# Altium schematic sheet MCU_1.SchDoc
size A; SheetNumber: 4; SheetTotal: 5
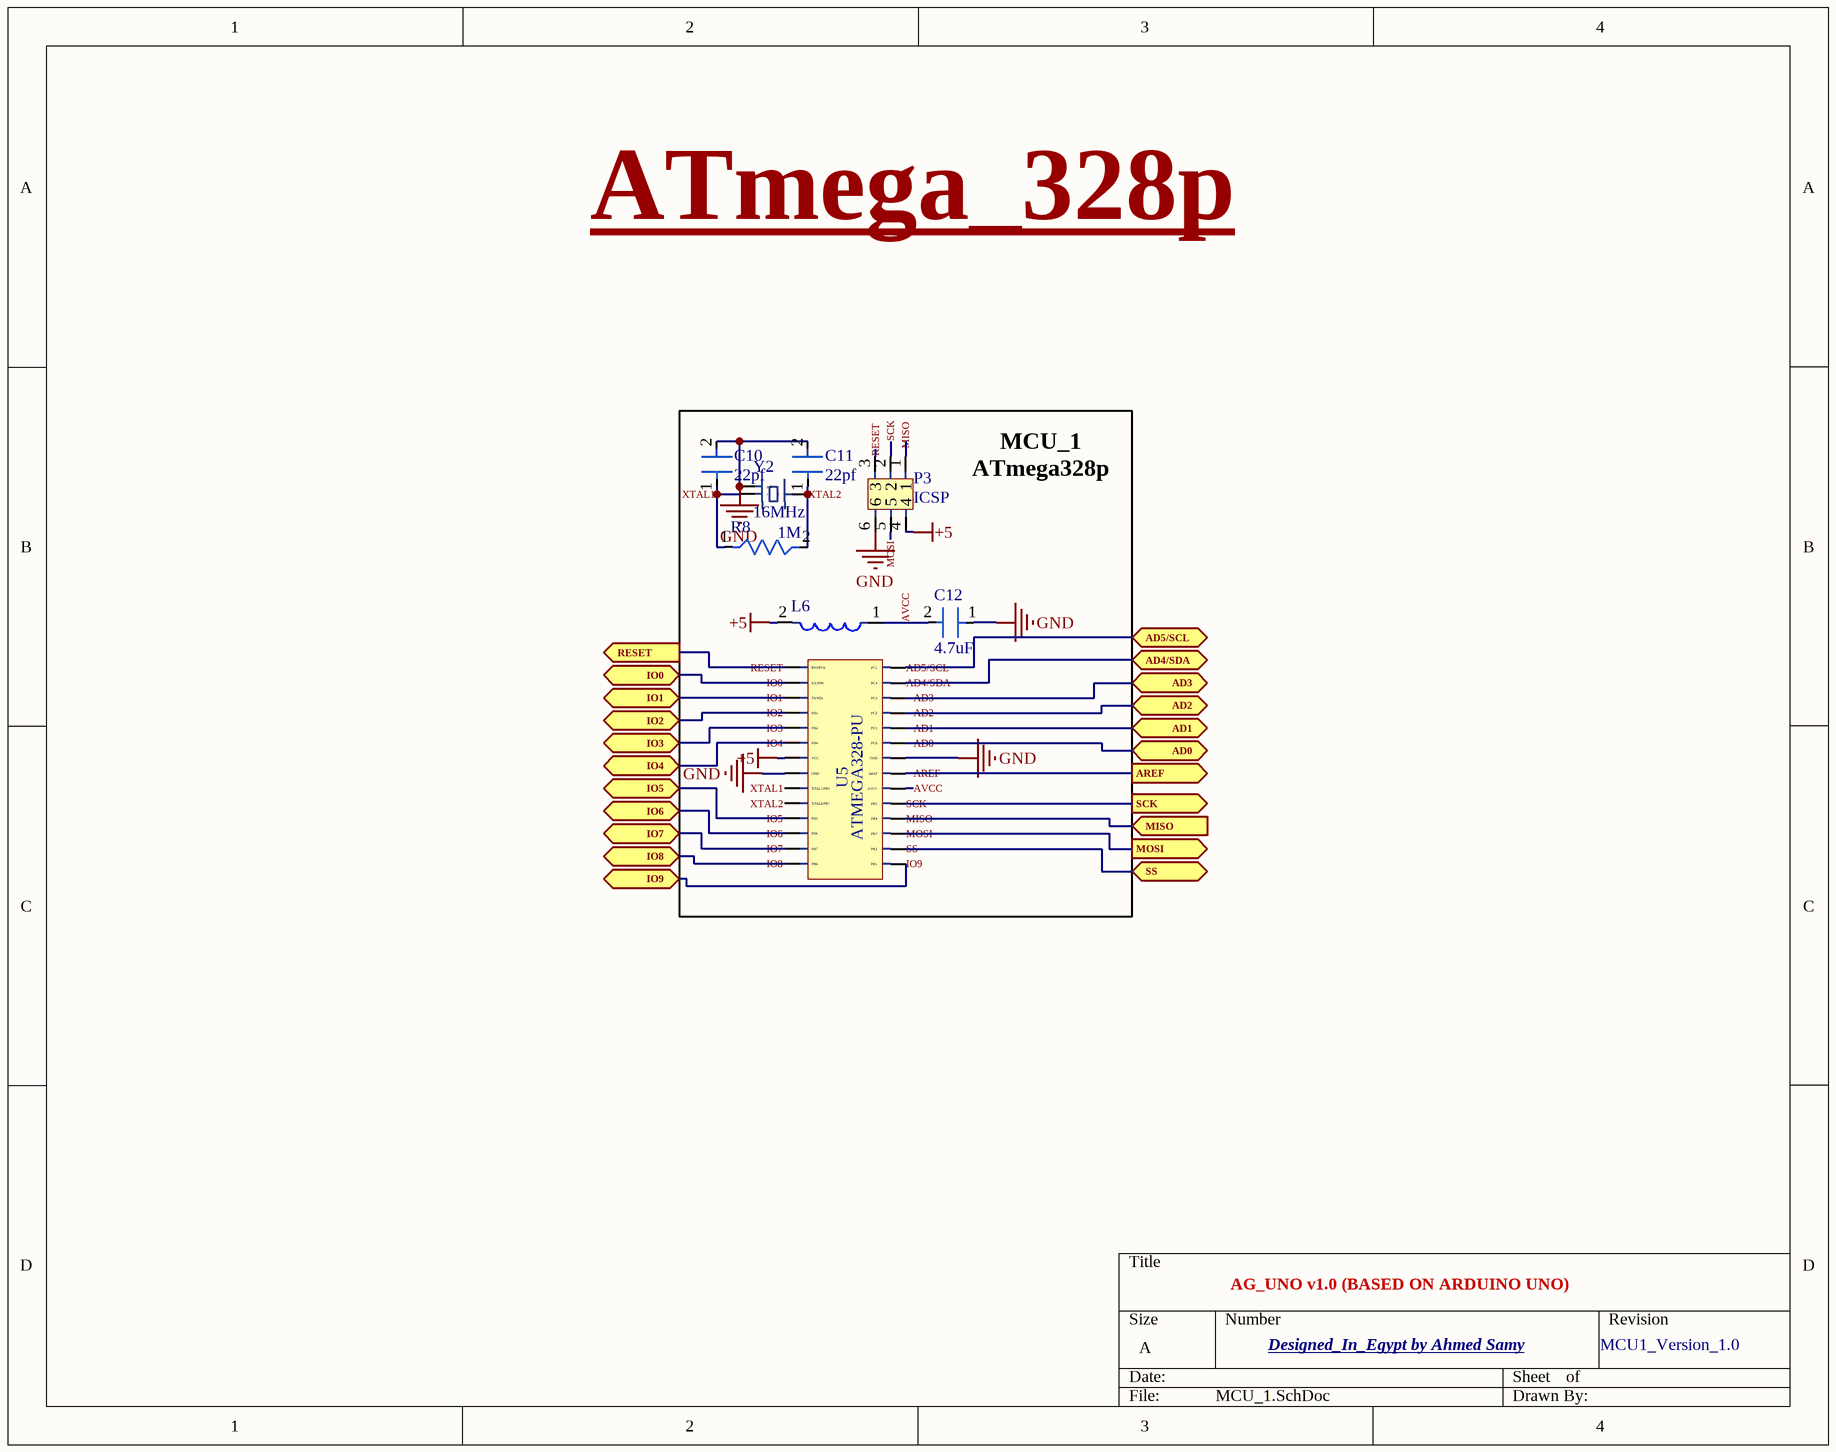
[diagram p0: MCU_1.SchDoc]

## Parts
C10  22pf  [3372-0805W475K500CCTR-ND]
C11  22pf  [3372-0805W475K500CCTR-ND]
C12  4.7uF  [3372-0805W475K500CCTR-ND]
L6  CV201210-100K  [CV201210-100K]  (value not drawn)
P3  ICSP  [PH2-06-UA]
R8  1M  [CRCW06031M00JNEAC]
U5  ATMEGA328-PU  [ATMEGA328-PU]
Y2  16MHz  [CSTCE16M0V53-R0]

## Ports
AD0 (bidir), AD1 (bidir), AD2 (bidir), AD3 (bidir), AD4/SDA (bidir), AD5/SCL (bidir), AREF (out), IO0 (bidir), IO1 (bidir), IO2 (bidir), IO3 (bidir), IO4 (bidir), IO5 (bidir), IO6 (bidir), IO7 (bidir), IO8 (bidir), IO9 (bidir), MISO (in), MOSI (out), RESET (out), SCK (out), SS (bidir)

## Nets
+5: L6.2 P3.4 U5.7(VCC)
GND: C10.2 C11.2 C12.1 P3.6 U5.8(GND) U5.22(GND) Y2.2(gnd)
AD0: U5.23(PC0) ; port AD0
AD1: U5.24(PC1) ; port AD1
AD2: U5.25(PC2) ; port AD2
AD3: U5.26(PC3) ; port AD3
AD4/SDA: U5.27(PC4) ; port AD4/SDA
AD5/SCL: U5.28(PC5) ; port AD5/SCL
AREF: U5.21(AREF) ; port AREF
AVCC: C12.2 L6.1 U5.20(AVCC)
IO0: U5.2(RX/PD0) ; port IO0
IO1: U5.3(TX/PD1) ; port IO1
IO2: U5.4(PD2) ; port IO2
IO3: U5.5(PD3) ; port IO3
IO4: U5.6(PD4) ; port IO4
IO5: U5.11(PD5) ; port IO5
IO6: U5.12(PD6) ; port IO6
IO7: U5.13(PD7) ; port IO7
IO8: U5.14(PB0) ; port IO8
IO9: U5.15(PB1) ; port IO9
MISO: P3.1 U5.18(PB4) ; port MISO
MOSI: P3.5 U5.17(PB3) ; port MOSI
RESET: P3.3 U5.1(RST/PC6) ; port RESET
SCK: P3.2 U5.19(PB5) ; port SCK
SS: U5.16(PB2) ; port SS
XTAL1: C10.1 R8.1 U5.9(XTAL1/PB6) Y2.1
XTAL2: C11.1 R8.2 U5.10(XTAL2/PB7) Y2.3

## Notes on the sheet
- ATmega_328p
- (near P3) MCU_1
  ATmega328p
- AG_UNO v1.0 (BASED ON ARDUINO UNO)
- Designed_In_Egypt by Ahmed Samy
- MCU1_Version_1.0

## Library data of the parts
C10-C12 = 3372-0805W475K500CCTR-ND: CAP.,SMD,0805,X5R,4.7UF,10%,50V
L6 = CV201210-100K: 10 µH Shielded Multilayer Inductor 15 mA 1.15Ohm Max 0805 (2012 Metric)
P3 = PH2-06-UA: Connector Header Through Hole 6 position 0.100" (2.54mm) [ICSP UNO]
R8 = CRCW06031M00JNEAC: 1 MOhms ±5% 0.1W, 1/10W Chip Resistor 0603 (1608 Metric) Thick Film
U5 = ATMEGA328-PU: AVR AVR® ATmega Microcontroller IC 8-Bit 20MHz 32KB (16K x 16) FLASH 28-PDIP
Y2 = CSTCE16M0V53-R0: 16 MHz Ceramic Resonator Built in Capacitor 15 pF ±0.3% -20°C ~ 80°C Surface Mount